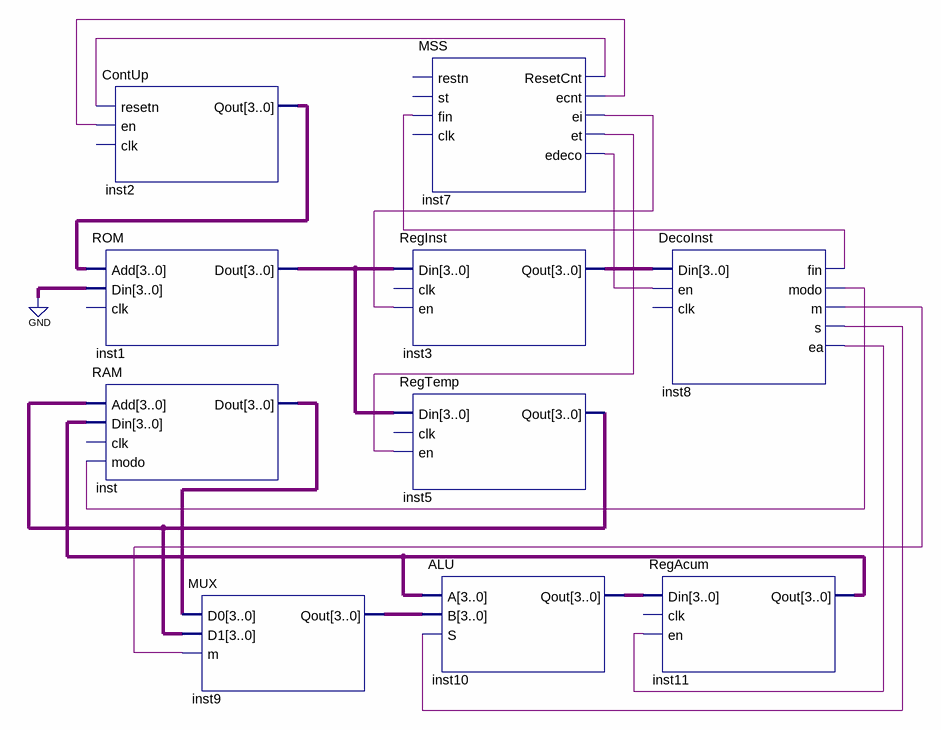
[diagram p0: schematic sheet]
// Quartus schematic microprocesador.bdf as structural Verilog: 10 symbols, 0 pins
module microprocesador (
);

  wire inst7_ecnt, inst7_edeco, inst7_ei, inst7_et, inst7_resetcnt, inst8_ea, inst8_fin, inst8_m, inst8_modo,
       inst8_s;
  wire [3:0] inst1_dout, inst2_qout, inst3_qout, inst5_qout, inst9_qout, inst10_qout, inst11_qout, inst_dout;

  ROM inst1 (.Add(inst2_qout), .Din(4'b0000), .Dout(inst1_dout));  // open: clk
  RAM inst (.Add(inst5_qout), .Din(inst11_qout), .modo(inst8_modo), .Dout(inst_dout));  // open: clk
  ContUp inst2 (.resetn(inst7_resetcnt), .en(inst7_ecnt), .Qout(inst2_qout));  // open: clk
  MUX inst9 (.D0(inst_dout), .D1(inst5_qout), .m(inst8_m), .Qout(inst9_qout));
  RegInst inst3 (.Din(inst1_dout), .en(inst7_ei), .Qout(inst3_qout));  // open: clk
  RegTemp inst5 (.Din(inst1_dout), .en(inst7_et), .Qout(inst5_qout));  // open: clk
  MSS inst7 (
    .fin(inst8_fin), .ResetCnt(inst7_resetcnt), .ecnt(inst7_ecnt), .ei(inst7_ei), .et(inst7_et),
    .edeco(inst7_edeco));  // open: restn, st, clk
  ALU inst10 (.A(inst11_qout), .B(inst9_qout), .S(inst8_s), .Qout(inst10_qout));
  DecoInst inst8 (
    .Din(inst3_qout), .en(inst7_edeco), .fin(inst8_fin), .modo(inst8_modo), .m(inst8_m), .s(inst8_s),
    .ea(inst8_ea));  // open: clk
  RegAcum inst11 (.Din(inst10_qout), .en(inst8_ea), .Qout(inst11_qout));  // open: clk
endmodule
